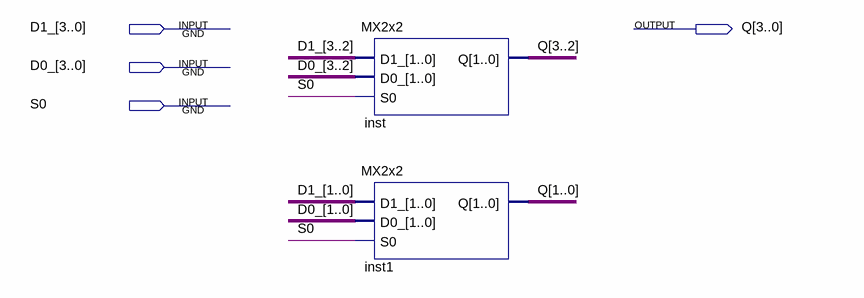
[diagram p0: schematic sheet]
// Quartus schematic MX2x4.bdf as structural Verilog: 2 symbols, 4 pins
module MX2x4 (
  input  [3:0] D1_,
  input  [3:0] D0_,
  input  S0,
  output [3:0] Q
);

  MX2x2 inst (.D1_(D1_[3:2]), .D0_(D0_[3:2]), .S0(S0), .Q(Q[3:2]));
  MX2x2 inst1 (.D1_(D1_[1:0]), .D0_(D0_[1:0]), .S0(S0), .Q(Q[1:0]));
endmodule
